# EAGLE design barometer copy (EAGLE 9.6.2)
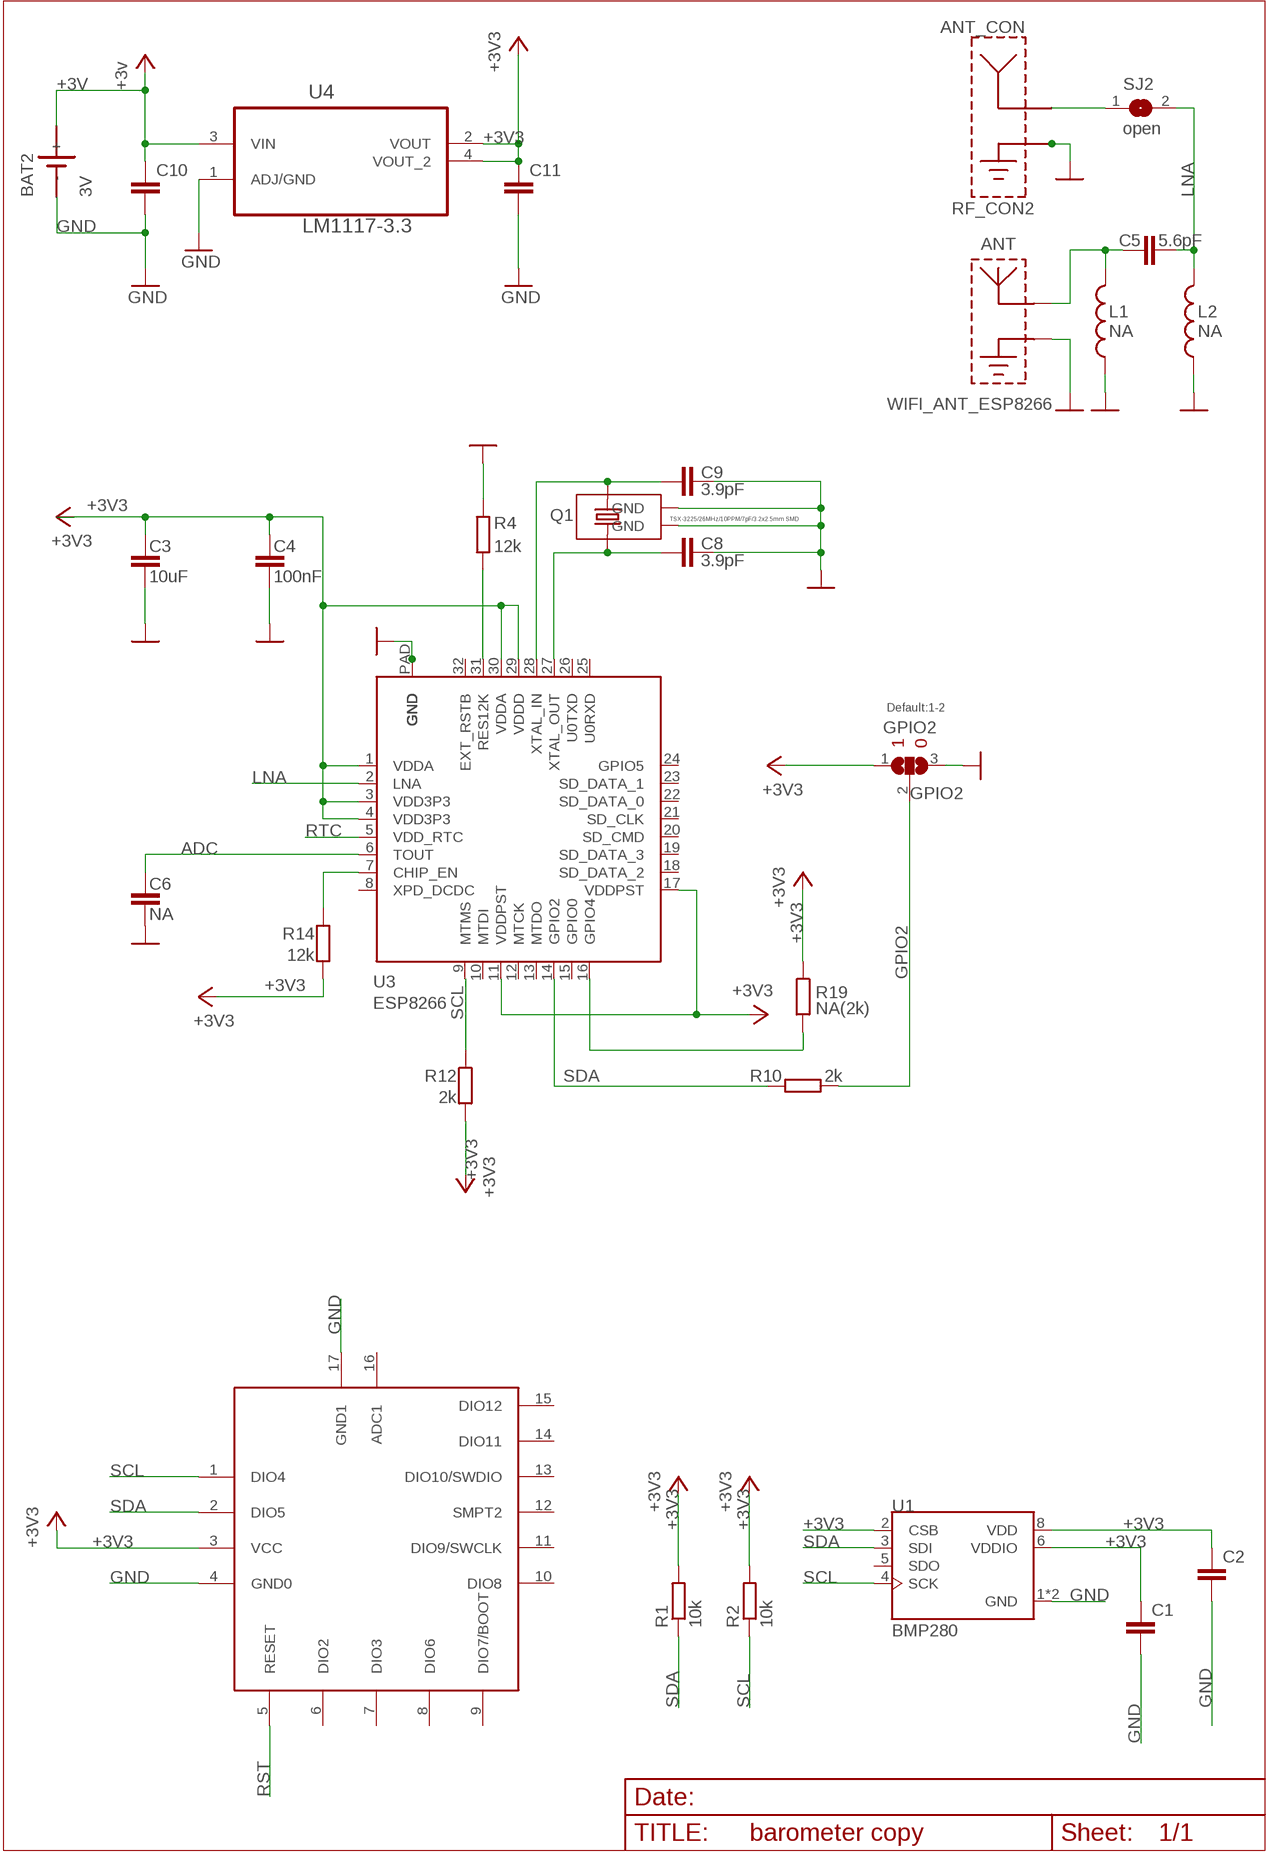
[diagram p0: schematic, sheet 1, part 1 of 2]
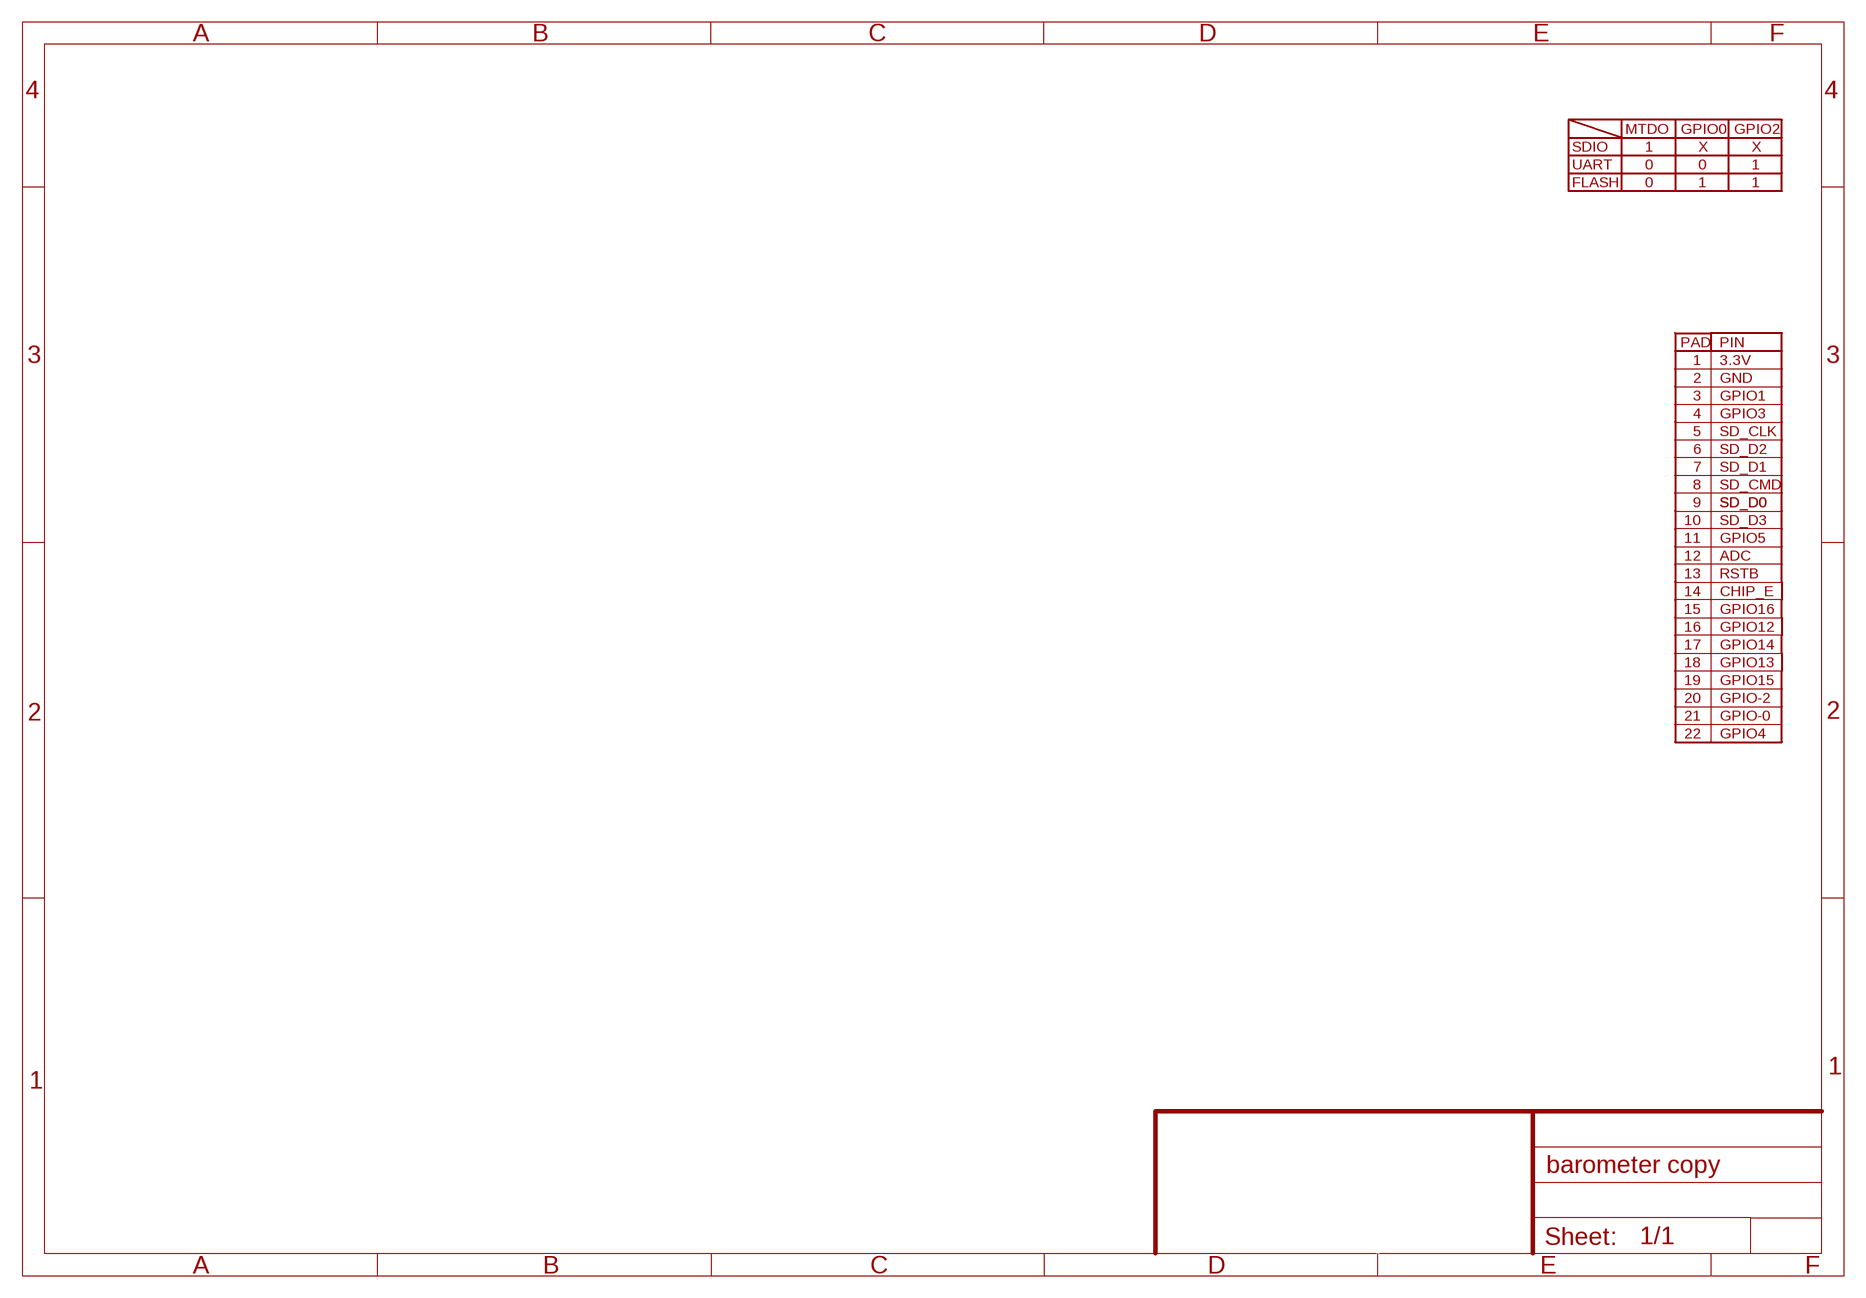
[diagram p1: schematic, sheet 1, part 2 of 2]

## Parts
ANT  WIFI_ANT_ESP8266  [ESP8266_ANT]
ANT_CON  RF_CON2  [RF_CONNECTOR_I-PEX_NO_CREAM]
BAT2  3V  SN2032  [SN2032]
C1  47u  C-EUC1206  [C1206]
C2  47u  C-EUC1206  [C1206]
C3  10uF  C-EUC0603_DWS  [C0603_DWS]
C4  100nF  C-EUC0402_TI  [C0402_TI]
C5  5.6pF  C-EUC0402_TI  [C0402_TI]
C6  NA  C-EUC0402_TI  [C0402_TI]
C8  3.9pF  C-EUC0402_TI  [C0402_TI]
C9  3.9pF  C-EUC0402_TI  [C0402_TI]
C10  47u  C-EUC1206  [C1206]
C11  10u  C-EUC1206  [C1206]
GPIO2  Default:1-2  SJ2W4  [SJ_2_SMALLER]
L1  NA  L-USL0402_TI  [L0402_TI]
L2  NA  L-USL0402_TI  [L0402_TI]
Q1  TSX-3225/26MHz/10PPM/7pF/3.2x2.5mm SMD  SMALL_SMD_CRYSTAL_1  [NX3225SA]
R1  10k  R-EU_R0402  [R0402]
R2  10k  R-EU_R0402  [R0402]
R4  12k  R-EU_R0402_TI  [R0402_TI]
R10  2k  R-EU_R0402_TI  [R0402_TI]
R12  2k  R-EU_R0402_TI  [R0402_TI]
R14  12k  R-EU_R0402_TI  [R0402_TI]
R19  NA(2k)  R-EU_R0402_TI  [R0402_TI]
SJ2  open  SJSJ_SMALLER  [SJ_1_SMALLER]
U1  BMP280  [XDCR_BMP280]
U3  ESP8266  [QFN32_PAD]
U4  LM1117-3.3  [SOT230]
U$1  BLUENRG-234BLEMODULE  [BLUENRG-234BLEMODULE]

## Nets
+3V [supply]: BAT2.+ C10.1 U4.3(VIN) ; supply symbol labelled +3v
+3V3 [supply]: C1.1 C2.1 C3.1 C4.1 C11.1 GPIO2.1 R1.2 R2.2 R12.2 R14.2 R19.1 U1.2(CSB) U1.6(VDDIO) U1.8(VDD) U3.1(VDDA) U3.3(VDD3P3) U3.4(VDD3P3) U3.11(VDDPST) U3.17(VDDPST) U3.29(VDDD) U3.30(VDDA) U4.2(VOUT) U4.4(VOUT_2) U$1.3(VCC)
ADC: C6.1 U3.6(TOUT)
GND: ANT.GND ANT_CON.1(GND_1) ANT_CON.2(GND_2) BAT2.- C1.2 C2.2 C3.2 C4.2 C6.2 C8.1 C9.1 C10.2 C11.2 GPIO2.3 L1.1 L2.1 Q1.NC_1(GND) Q1.NC_2(GND) R4.2 U1.1(GND) U1.7(GND) U3.P$1(GND) U3.P$2(GND) U3.P$3(GND) U3.P$4(GND) U3.P$5(GND) U3.P$6(GND) U3.P$7(GND) U3.P$8(GND) U3.P$9(GND) U3.PAD(GND) U4.1(ADJ/GND) U$1.4(GND0) U$1.17(GND1)
GPIO2: GPIO2.2 R10.1
GPIO4: R19.2 U3.16(GPIO4)
LNA: C5.2 L2.2 SJ2.2 U3.2(LNA)
N$7: ANT_CON.ANT SJ2.1
N$11: R14.1 U3.7(CHIP_EN)
N$14: ANT.ANT C5.1 L1.2
N$21: C8.2 Q1.2 U3.27(XTAL_OUT)
N$22: R4.1 U3.31(RES12K)
N$23: C9.2 Q1.1 U3.28(XTAL_IN)
RST: U$1.5(RESET)
RTC: U3.5(VDD_RTC)
SCL: R2.1 R12.1 U1.4(SCK) U3.9(MTMS) U$1.1(DIO4)
SDA: R1.1 R10.2 U1.3(SDI) U3.14(GPIO2) U$1.2(DIO5)
Unconnected: U1.5(SDO) U3.8(XPD_DCDC) U3.10(MTDI) U3.12(MTCK) U3.13(MTDO) U3.15(GPIO0) U3.18(SD_DATA_2) U3.19(SD_DATA_3) U3.20(SD_CMD) U3.21(SD_CLK) U3.22(SD_DATA_0) U3.23(SD_DATA_1) U3.24(GPIO5) U3.25(U0RXD) U3.26(U0TXD) U3.32(EXT_RSTB) U$1.6(DIO2) U$1.7(DIO3) U$1.8(DIO6) U$1.9(DIO7/BOOT) U$1.10(DIO8) U$1.11(DIO9/SWCLK) U$1.12(SMPT2) U$1.13(DIO10/SWDIO) U$1.14(DIO11) U$1.15(DIO12) U$1.16(ADC1)

## Notes on the sheet
- MTDO | GPIO0 | GPIO2
- SDIO | 1 | X | X
- UART | 0 | 0 | 1
- FLASH | 0 | 1 | 1
- PAD | PIN
- 1 | 3.3V
- 2 | GND
- 3 | GPIO1
- 4 | GPIO3
- 5 | SD_CLK
- 6 | SD_D2
- 7 | SD_D1
- 8 | SD_CMD
- 9 | SD_D0 | SD_D0
- 10 | SD_D3
- 1 | 0 | 11 | GPIO5
- 12 | ADC
- 13 | RSTB
- 14 | CHIP_E
- 15 | GPIO16
- 16 | GPIO12
- 17 | GPIO14
- 18 | GPIO13
- 19 | GPIO15
- 20 | GPIO-2
- 21 | GPIO-0
- 22 | GPIO4

## Library data of the parts
ANT = OLIMEX_ANT:WIFI_ANT_ESP8266
ANT_CON = OLIMEX_CONNECTORS:RF_CON
BAT2 = sn2032:SN2032: LI BATTERY
C1 C2 C10 C11 = rcl:C-EU: CAPACITOR, European symbol; SPICEPREFIX: C
C3-C6 C8 C9 = rcl:C-EU: CAPACITOR, European symbol
GPIO2 = jumper:SJ2W: SMD solder JUMPER
L1 L2 = rcl:L-US: INDUCTOR, American symbol
Q1 = OLIMEX_DISCRET:SMALL_SMD_CRYSTAL
R1 R2 = rcl:R-EU_: RESISTOR, European symbol; SPICEPREFIX: R
R4 R10 R12 R14 R19 = rcl:R-EU_: RESISTOR, European symbol
SJ2 = jumper:SJ: SMD solder JUMPER
U1 = BMP280:BMP280: BMP280 Absolute Barometric Pressure Sensor for Battery Powered Devices 2 x 2.5mm Check availability <https://pricing.snapeda.com/parts/BMP280/Bosch/view-part?ref=eda>; AVAILABILITY: In Stock; DESCRIPTION: Pressure Sensor 4.35PSI ~ 15.95PSI (30kPa ~ 110kPa) Absolute - 16b 8-SMD; MF: Bosch; MP: BMP280; PACKAGE: LGA-8 Bosch Tools; PRICE: None; PURCHASE-URL: https://pricing.snapeda.com/search/part/BMP280/?ref=eda
U3 = OLIMEX_IC:ESP8266
U4 = LM1117-3.3:LM1117-3.3: IC REG LDO 800MA 3.3V Check prices <https://pricing.snapeda.com/parts/LM1117-3.3/Texas%20Instruments/view-part?ref=eda>; AVAILABILITY: In Stock; DESCRIPTION: Linear Voltage Regulator IC Positive Fixed 1 Output 800mA DDPAK/TO-263-3; MF: Texas Instruments; MP: LM1117-3.3; PACKAGE: None; PRICE: None
U$1 = BLUENRG-234blemodule:BLUENRG-234BLEMODULE: BLUENRG-234 BLE Module

## Net classes
1 supply: width 0.406 mm, clearance 0.203 mm

## Board
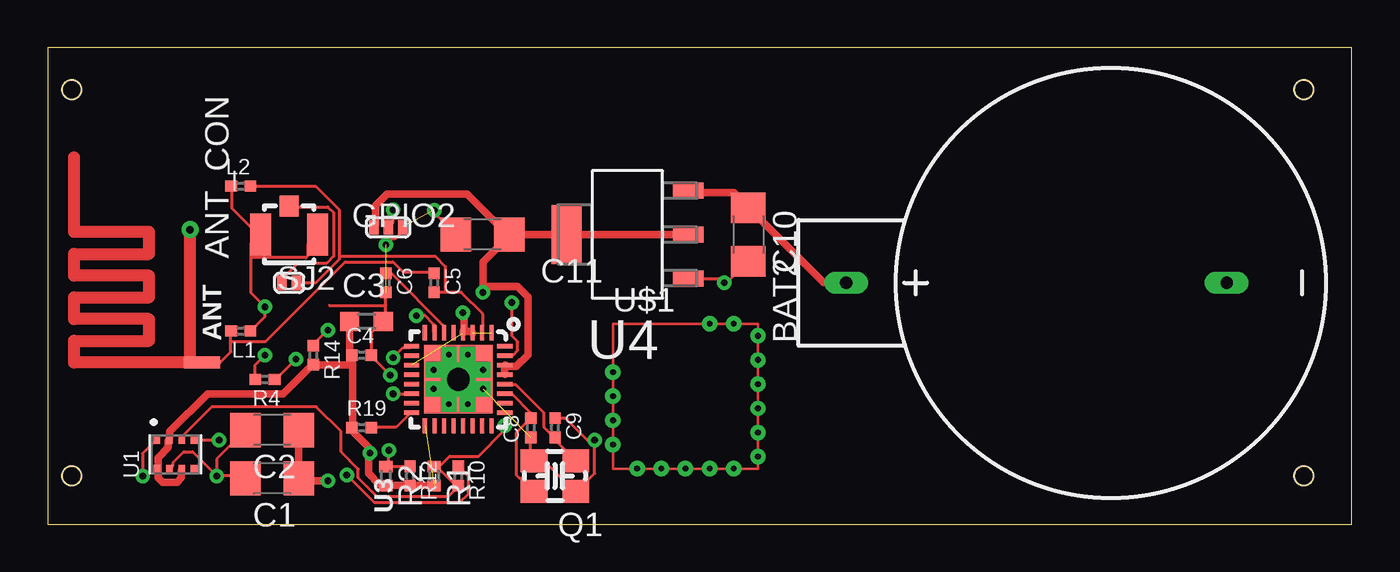
[diagram p2: board, top side]
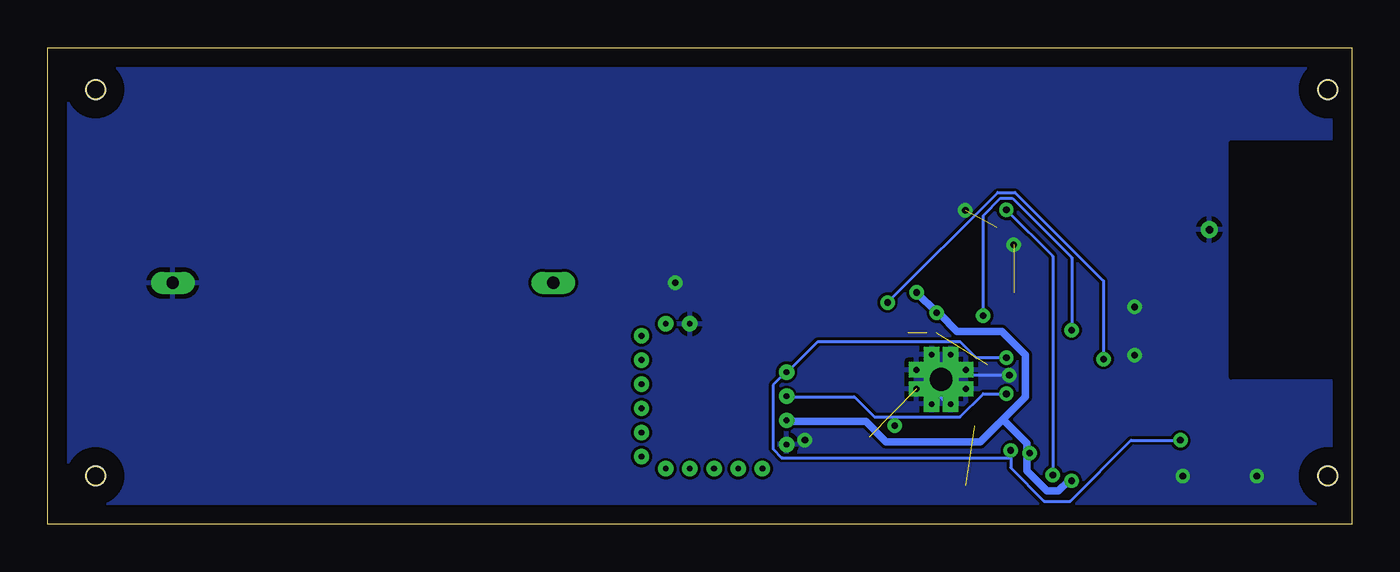
[diagram p3: board, bottom side, seen from below]

Size 68.56 x 25.07 mm. Coordinates in mm from the lower left corner, seen from the top.
Outline: 0.77,2.51 arc174 1.77,2.51 1.77,2.57 arc174 0.77,2.57 0.77,2.51
Outline: 0.77,22.83 arc174 1.77,22.83 1.77,22.89 arc174 0.77,22.89 0.77,22.83
Outline: 65.54,22.83 arc174 66.54,22.83 66.54,22.89 arc174 65.54,22.89 65.54,22.83
Outline: 65.54,2.51 arc174 66.54,2.51 66.54,2.57 arc174 65.54,2.57 65.54,2.51
Outline: 0,25.07 0,0 68.56,0 68.56,25.07 0,25.07
Copper layers (1*16): Top 0.035mm / dielectric 1.5mm / Bottom 0.035mm
Design rules "default": minimum track width 6mil, minimum drill 0.35mm, track to track 6mil, track to pad 6mil, pad to pad 6mil, via to via 6mil, smd to smd 6mil, copper to edge 40mil, drill to drill 6mil, minimum pad ring 10mil, minimum via ring 8mil, stop-mask expansion 4mil, vias tented up to drill 0mil, thermal gap 10mil
Holes 1 mm at 1.27,2.54 1.27,22.86 66.04,22.86 66.04,2.54

### Footprints (pad centres in the part's own frame; a part is rotated, then mirrored left to right if it is on the bottom)
ESP8266_ANT = smd 0.635 x 1.905: ANT -5.334,-3.302 | drill 0.4 pad 0.635: GND 1.651,-2.667
RF_CONNECTOR_I-PEX_NO_CREAM = smd 2.2 x 1.1: 1 0,1.5; 2 0,-1.5 | smd 1.1 x 1: ANT 1.5,0
SN2032 = drill 0.65 long: + 0,13.9; - 0,-6.1
C1206 = smd 1.6 x 1.8: 1 -1.4,0; 2 1.4,0
C0603_DWS = smd 1.016 x 1.016: 1 -0.889,0; 2 0.889,0
C0402_TI = smd 0.61 x 0.584: 1 -0.508,0; 2 0.508,0
SJ_2_SMALLER = smd 0.508 x 0.762: 1 -0.762,0; 2 0,0; 3 0.762,0
L0402_TI = smd 0.61 x 0.584: 1 -0.508,0; 2 0.508,0
NX3225SA = smd 1.4 x 1.2: 1 -1.1,-0.8; 2 1.1,0.8; NC_1 1.1,-0.8; NC_2 -1.1,0.8
R0402 = smd 0.6 x 0.7: 1 -0.5,0; 2 0.5,0
R0402_TI = smd 0.61 x 0.584: 1 -0.508,0; 2 0.508,0
SJ_1_SMALLER = smd 0.508 x 0.762: 1 -0.381,0; 2 0.381,0
XDCR_BMP280 = smd 0.5 x 0.35: 1 0.8,0.975; 2 0.8,0.325; 3 0.8,-0.325; 4 0.8,-0.975; 5 -0.8,-0.975; 6 -0.8,-0.325; 7 -0.8,0.325; 8 -0.8,0.975
QFN32_PAD = smd 0.8 x 0.23: 1 -2.45,1.75; 2 -2.45,1.25; 3 -2.45,0.75; 4 -2.45,0.25; 5 -2.45,-0.25; 6 -2.45,-0.75; 7 -2.45,-1.25; 8 -2.45,-1.75; 17 2.45,-1.75; 18 2.45,-1.25; 19 2.45,-0.75; 20 2.45,-0.25; 21 2.45,0.25; 22 2.45,0.75; 23 2.45,1.25; 24 2.45,1.75 | smd 0.23 x 0.8: 9 -1.75,-2.45; 10 -1.25,-2.45; 11 -0.75,-2.45; 12 -0.25,-2.45; 13 0.25,-2.45; 14 0.75,-2.45; 15 1.25,-2.45; 16 1.75,-2.45; 25 1.75,2.45; 26 1.25,2.45; 27 0.75,2.45; 28 0.25,2.45; 29 -0.25,2.45; 30 -0.75,2.45; 31 -1.25,2.45; 32 -1.75,2.45 | drill 1.2 pad 1.422 square: P$1 0,0 | drill 0.3 pad 0.4 square: P$2 0.5,1.3; P$3 -0.5,1.3; P$4 -1.3,0.5; P$5 -1.3,-0.5; P$6 -0.5,-1.3; P$7 0.5,-1.3; P$8 1.3,-0.5; P$9 1.3,0.5 | smd 3.6 x 3.6: PAD 0,0
SOT230 = smd 1.6 x 0.838: 1 -3.2,2.311; 2 -3.2,0; 3 -3.2,-2.311 | smd 1.6 x 3.099: 4 3.2,0
BLUENRG-234BLEMODULE = drill 0.3 pad 0.813: 1 -3.81,1.27 | drill 0.3: 2 -3.81,0; 3 -3.81,-1.27; 4 -3.81,-2.54; 5 -2.54,-3.81; 6 -1.27,-3.81; 7 0,-3.81; 8 1.27,-3.81; 9 2.54,-3.81; 10 3.81,-3.175; 11 3.81,-1.905; 12 3.81,-0.635; 13 3.81,0.635; 14 3.81,1.905; 15 3.81,3.175; 16 2.54,3.81; 17 1.27,3.81

### Placement (x,y rotation side)
ANT  4.83,13.84 90 top
ANT_CON  12.7,15.24 90 top
BAT2  55.88,12.7 90 top
C1  11.81,2.41 180 top
C2  11.81,4.95 180 top
C3  16.76,10.67 0 top
C4  16.51,8.89 0 top
C5  20.32,12.7 270 top
C6  17.78,12.7 270 top
C8  25.4,5.08 90 top
C9  26.67,5.08 270 top
C10  36.83,15.24 270 top
C11  22.86,15.24 180 top
GPIO2  17.91,15.62 0 top
L1  10.16,10.16 180 top
L2  10.16,17.78 0 top
Q1  26.67,2.54 180 top
R1  20.32,2.54 270 top
R2  17.78,2.54 270 top
R4  11.43,7.62 180 top
R10  21.59,2.54 270 top
R12  19.05,2.54 270 top
R14  13.97,8.89 270 top
R19  16.51,5.08 0 top
SJ2  12.7,12.7 0 top
U1  6.73,3.68 90 top
U3  21.59,7.62 270 top
U4  30.48,15.24 180 top
U$1  33.53,6.73 0 top

### Tracks (layer width: path | path; a pad name or v marks a point on that pad's centre or on a via)
+3V
  Top 0.406: 34.06,17.55 U4.3 34.24,17.45 36.07,17.45 36.83,16.69 C10.1 36.98,16.54 40.79,12.72 41.93,12.72 BAT2.+
+3V3  (via drill 0.35)  (3 unrouted)
  Top 0.406: C11.1 24.26,15.14 | 17.14,15.64 GPIO2.1 | 17.14,15.49 GPIO2.1 | U1.6 7.04,2.82 7.04,2.44 6.81,2.21 6.04,2.21 5.82,2.44 5.82,2.74 U1.8 5.82,2.9 5.82,3.5 6.35,4.04 6.35,4.42 U1.2 6.43,4.65 6.43,4.88 8.41,6.86 12.37,6.86 13.82,8.31 R14.2 16.03,8.38 | R1.2 20.3,2.06 19.07,2.06 R12.2 18.92,2.06 17.78,2.06 R2.2 17.63,2.13 17.4,2.13 16.87,2.67 16.87,3.73 | 16.03,8.38 16.03,8.84 C4.1 15.88,8.99 C3.1 | 16.03,8.38 16.03,5.11 R19.1 15.95,4.95 16.87,4.04 16.87,3.73 | U4.2 U4.4 C11.1 | C2.1 13.21,2.44 C1.1 13.36,2.29 v14.73,2.29 | U3.29 24.03,7.92 24.03,8.31 U3.30 24.18,8.31 24.64,8.31 25.25,8.91 25.25,11.96 24.71,12.5 23.04,12.5 v22.89,12.19 22.89,13.79 24.11,15.01 C11.1 | U3.3 22.28,10.13 21.89,10.13 U3.4 21.89,10.29 21.89,11.05 v21.82,11.12 | GPIO2.1 17.25,15.77 17.25,16.76 17.86,17.37 22.05,17.37 24.11,15.32 C11.1 | v16.94,3.73 16.87,3.73
  Bottom 0.406: v22.89,12.19 v21.82,11.12 21.67,11.05 20.75,10.13 18.39,10.13 17.17,8.91 17.17,6.71 18.35,5.52 | 18.35,5.52 19.53,4.34 24.49,4.34 25.55,5.41 29.67,5.41 U$1.3 | v14.73,2.29 14.88,2.29 15.42,1.75 16.03,1.75 17.09,2.82 17.09,3.73 | 17.09,3.73 17.09,4.27 18.35,5.52 | v16.94,3.73 17.09,3.73
ADC
  Top 0.152: C6.1 17.78,13.18 18.09,13.18 20.83,10.44 20.83,10.13 U3.6
GND  (via drill 0.35)  (3 unrouted)
  Top 0.152: C8.1 25.4,3.5 25.55,3.35 Q1.NC_1 25.63,3.28 26.16,3.28 27.76,1.68 Q1.NC_2 27.84,1.75 28.75,2.67 28.75,4.04 28.56,4.23 | 28.56,4.23 27.27,5.52 | 27.27,5.52 27.23,5.56 26.7,5.56 C9.1 | 33.63,12.88 U4.1 35.33,12.93 v35.56,12.7 35.69,12.7 C10.2 | 27.3,5.56 27.27,5.52 | 6.43,2.9 U1.7 6.6,3.08 6.6,3.25 7.16,3.81 7.62,3.81 v8.89,2.54 | 10.39,2.44 C1.2 10.28,2.54 v8.89,2.54 | 10.39,4.34 10.39,4.95 C2.2 8.89,3.43 v8.89,2.54 | 17.78,11.51 17.78,10.74 17.7,10.67 C3.2 17.63,10.67 17.02,10.06 C4.2 17.02,8.84 v18.01,7.85 | 17.78,11.51 C6.2 | 10.85,7.54 R4.2 10.92,8.38 v11.43,8.89 | 5.82,4.5 U1.1 | 14.81,11.51 17.78,11.51 | 5.74,4.42 U1.1 | 10.69,14.02 10.69,14.78 11.15,15.24 ANT_CON.1 11.07,15.24 9.7,16.61 9.7,17.75 L2.1 | 10.69,10.21 L1.1 11.43,10.92 v11.43,11.43 10.69,12.17 10.69,14.02 | 14.2,14.63 ANT_CON.2 13.68,14.72 13.68,14.11 13.59,14.02 10.69,14.02 | 18.62,15.32 18.62,15.62 GPIO2.3 18.67,15.43 18.26,15.01 18.09,15.01 v17.78,14.7 | v28.75,4.42 28.56,4.23 | U1.1 5,3.73 v5,2.54 | C11.2 20.32,16.38 v20.32,16.51
  Bottom 0.152: U3.P$1 21.59,6.63 21.36,6.4 21.13,6.4 21.13,6.48 21.21,6.55 21.29,6.55 21.29,6.48 21.21,6.48 21.13,6.55 20.9,6.55 20.83,6.48 20.83,6.17 20.98,6.02 21.13,6.02 21.29,6.17 21.36,6.17 21.44,6.25 U3.P$8 | v18.01,7.85 19.99,7.85 20.22,8.08 U3.P$6 | 29.67,4.19 U$1.4
  pour Bottom: -3.81,27.94 -3.81,-3.81 72.39,-3.81 72.39,27.94
GPIO2  (via drill 0.35)
  Top 0.152: R10.1 22.12,2.52 22.12,1.6 21.67,1.14 17.17,1.14 v15.72,2.59 | v18.16,16.54 18.16,15.85 17.93,15.62 GPIO2.2
  Bottom 0.152: v15.72,2.59 15.72,14.1 v18.16,16.54
GPIO4
  Top 0.152: R19.2 17.02,5.11 18.31,5.11 19.07,5.87 U3.16
LNA
  Top 0.152: 20.9,12.19 21.74,12.19 22.89,11.05 22.89,10.13 U3.2 | 20.9,12.19 C5.2 | 15.34,14.1 15.34,13.95 14.12,12.72 13.13,12.72 SJ2.2 | 15.34,14.1 15.34,16.54 14.12,17.75 10.69,17.75 L2.2 | 20.9,12.19 20.9,13.56 20.37,14.1 15.34,14.1
N$7
  Top 0.152: SJ2.1 12.37,12.72 12.37,12.95 13.13,13.72 14.66,13.72 15.04,14.1 15.04,16.38 14.73,16.69 12.75,16.69 ANT_CON.ANT
N$11  (via drill 0.35)
  Top 0.152: v14.73,10.21 13.97,9.45 R14.1 | v19.38,10.97 19.84,10.97 20.3,10.52 20.3,10.13 U3.7
  Bottom 0.152: v14.73,10.21 14.73,14.02 17.86,17.14 18.47,17.14 19.38,16.23 v19.38,10.97
N$14
  Top 0.152: 9.63,9.6 9.63,9.07 9.09,8.53 8.18,8.53 ANT.ANT | 9.63,9.6 9.63,10.13 L1.2 | 9.63,9.6 11.46,9.6 15.65,13.79 18.16,13.79 18.69,13.26 20.3,13.26 C5.1
N$21
  Top 0.152: U3.27 24.11,6.86 24.41,6.86 25.4,5.87 C8.2 25.4,5.56 24.64,4.8 24.64,2.59 24.79,2.44 24.87,2.44 25.55,1.75 Q1.2
N$22  (via drill 0.35)
  Top 0.152: v13.06,8.69 11.99,7.62 R4.1 | v24.41,11.66 24.41,9.91 24.71,9.6 24.71,9.14 24.49,8.91 24.11,8.91 U3.31
  Bottom 0.152: v13.06,8.69 13.06,12.8 17.7,17.45 18.62,17.45 v24.41,11.66
N$23
  Top 0.152: Q1.1 27.76,3.35 26.7,4.42 26.7,4.57 C9.2 26.62,4.57 26.09,5.11 26.09,5.87 24.64,7.32 24.11,7.32 U3.28
SCL  (via drill 0.35)
  Top 0.152: v9.02,4.42 7.72,4.42 U1.4 | v17.93,3.89 17.93,3.2 R2.1 17.86,3.05 R12.1 | v18.16,8.76 18.69,9.3 19.07,9.3 U3.9
  Bottom 0.152: v9.02,4.42 11.61,4.42 14.81,1.22 16.18,1.22 17.93,2.97 17.93,3.5 | v17.93,3.89 17.93,3.5 | v18.16,8.76 19.76,8.76 20.6,9.6 28.07,9.6 29.67,8 U$1.1 29.74,8 30.43,7.32 30.43,3.96 29.97,3.5 17.93,3.5
SDA  (via drill 0.35)
  Top 0.152: v18.16,6.86 19.07,6.86 U3.14 | U1.3 7.11,4.5 7.11,4.65 8.64,6.17 14.12,6.17 15.42,4.88 15.42,3.81 16.33,2.9 16.33,2.44 17.32,1.45 21.06,1.45 21.59,1.98 R10.2 21.51,1.98 20.52,2.97 | 20.52,2.97 20.37,2.97 R1.1 20.52,2.97 | v24.03,5.18 24.03,4.95 22.66,3.58 21.13,3.58 20.52,2.97
  Bottom 0.152: v18.16,6.86 19.38,6.86 20.6,5.64 24.03,5.64 | 24.03,5.64 25.09,5.64 26.16,6.71 29.67,6.71 U$1.2 | v24.03,5.18 24.03,5.64